# Altium project Stepper_Driver.PrjPcb
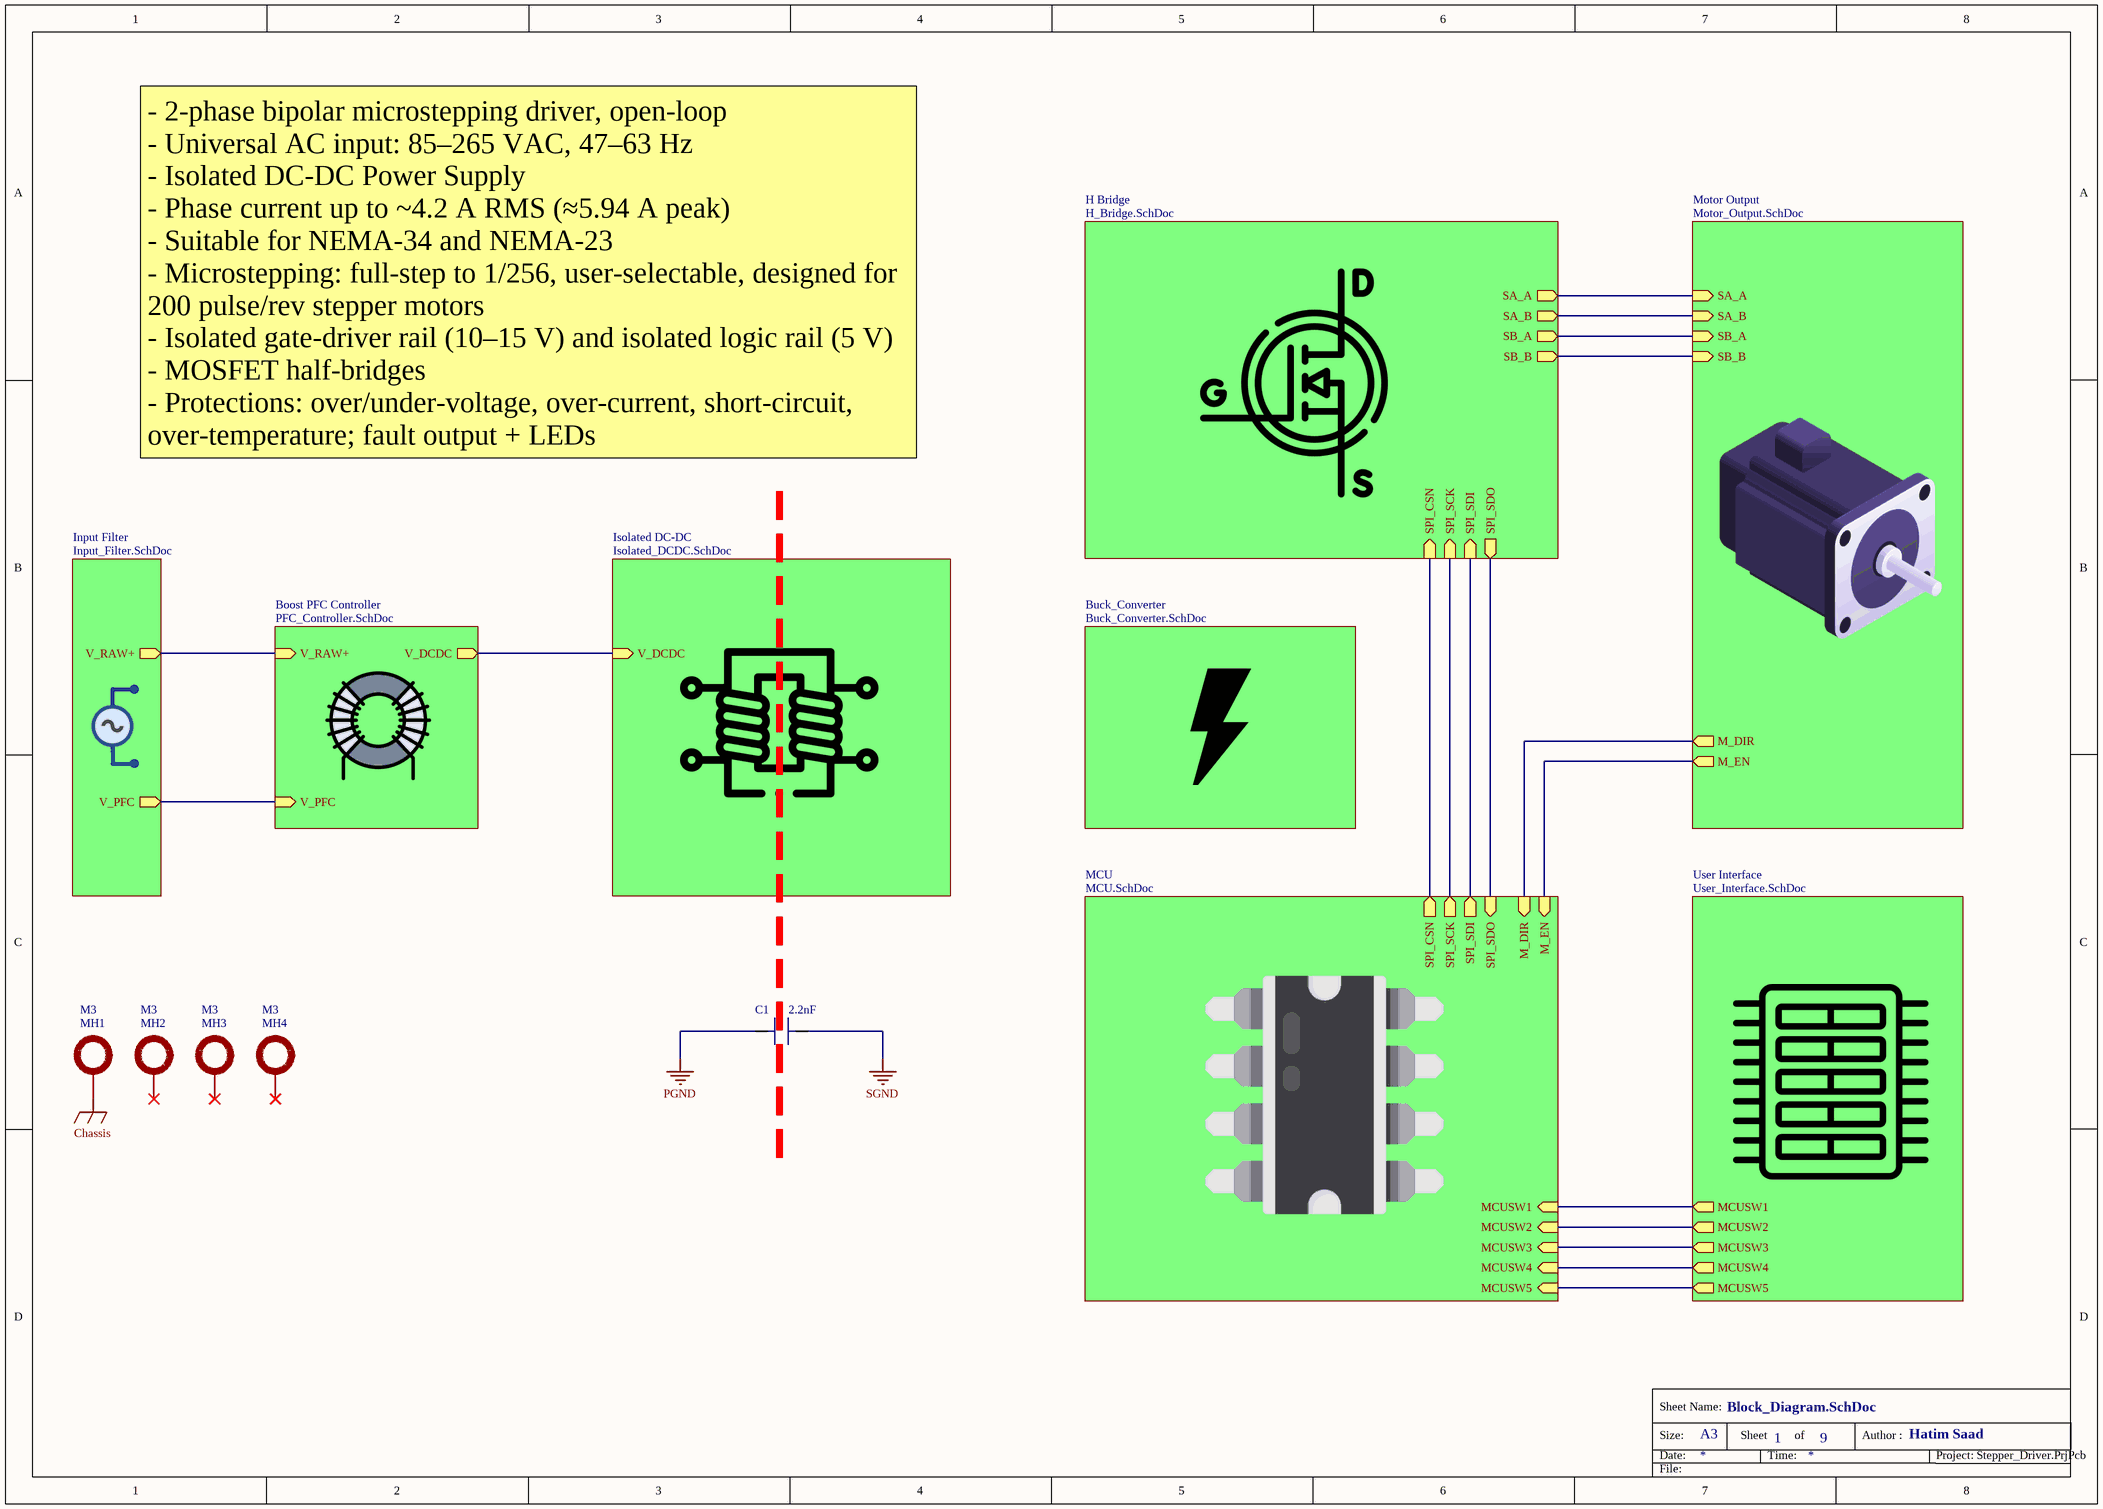
[diagram p0: Block_Diagram.SchDoc]
9 sheets, 208 parts. Net scope: hierarchical (ports join the sheet entries above them; power ports are global).
Board file: Stepper_Board.PcbDoc
Sheets:
  Block_Diagram.SchDoc
    Input Filter = Input_Filter.SchDoc
    Boost PFC Controller = PFC_Controller.SchDoc
    Isolated DC-DC = Isolated_DCDC.SchDoc
    H Bridge = H_Bridge.SchDoc
    MCU = MCU.SchDoc
    User Interface = User_Interface.SchDoc
    Motor Output = Motor_Output.SchDoc
    Buck_Converter = Buck_Converter.SchDoc

## Sheet Block_Diagram.SchDoc
size A3; SheetNumber: 1; SheetTotal: 9

### Parts
C1  2.2nF  [C10MM]
MH1  M3  [M3 Mounting Hole]  (no BOM)
MH2  M3  [M3 Mounting Hole]  (no BOM)
MH3  M3  [M3 Mounting Hole]  (no BOM)
MH4  M3  [M3 Mounting Hole]  (no BOM)

### Sub-sheets
Boost PFC Controller = PFC_Controller.SchDoc: V_RAW+ (in), V_PFC (in), V_DCDC (out)
Buck_Converter = Buck_Converter.SchDoc: no entries
H Bridge = H_Bridge.SchDoc: SPI_CSN (in), SPI_SCK (in), SPI_SDI (in), SPI_SDO (out), SA_A (out), SA_B (out), SB_A (out), SB_B (out)
Input Filter = Input_Filter.SchDoc: V_RAW+ (out), V_PFC (out)
Isolated DC-DC = Isolated_DCDC.SchDoc: V_DCDC (in)
MCU = MCU.SchDoc: SPI_CSN (out), SPI_SCK (out), SPI_SDI (out), SPI_SDO (in), MCUSW5 (in), MCUSW4 (in), MCUSW3 (in), MCUSW2 (in), MCUSW1 (in), M_DIR (in), M_EN (in)
Motor Output = Motor_Output.SchDoc: SA_A (in), SA_B (in), SB_A (in), SB_B (in), M_DIR (out), M_EN (out)
User Interface = User_Interface.SchDoc: MCUSW5 (out), MCUSW4 (out), MCUSW3 (out), MCUSW2 (out), MCUSW1 (out)

### Nets
Chassis: MH1.1
PGND: C1.1(A)
SGND: C1.2(B)
M_DIR: sheet MCU/M_DIR, sheet Motor Output/M_DIR
M_EN: sheet MCU/M_EN, sheet Motor Output/M_EN
MCUSW1: sheet MCU/MCUSW1, sheet User Interface/MCUSW1
MCUSW2: sheet MCU/MCUSW2, sheet User Interface/MCUSW2
MCUSW3: sheet MCU/MCUSW3, sheet User Interface/MCUSW3
MCUSW4: sheet MCU/MCUSW4, sheet User Interface/MCUSW4
MCUSW5: sheet MCU/MCUSW5, sheet User Interface/MCUSW5
MISO: sheet H Bridge/SPI_SDO, sheet MCU/SPI_SDO
MOSI: sheet H Bridge/SPI_SDI, sheet MCU/SPI_SDI
SA_A: sheet H Bridge/SA_A, sheet Motor Output/SA_A
SA_B: sheet H Bridge/SA_B, sheet Motor Output/SA_B
SB_A: sheet H Bridge/SB_A, sheet Motor Output/SB_A
SB_B: sheet H Bridge/SB_B, sheet Motor Output/SB_B
SCK: sheet H Bridge/SPI_SCK, sheet MCU/SPI_SCK
SCSN: sheet H Bridge/SPI_CSN, sheet MCU/SPI_CSN
V_DCDC: sheet Boost PFC Controller/V_DCDC, sheet Isolated DC-DC/V_DCDC
V_PFC: sheet Input Filter/V_PFC, sheet Boost PFC Controller/V_PFC
V_RAW+: sheet Input Filter/V_RAW+, sheet Boost PFC Controller/V_RAW+

Not connected (* = marked no-connect by the designer): MH2 1*; MH3 1*; MH4 1*

### Notes on the sheet
- - 2-phase bipolar microstepping driver, open-loop
  - Universal AC input: 85–265 VAC, 47–63 Hz
  - Isolated DC-DC Power Supply
  - Phase current up to ~4.2 A RMS (≈5.94 A peak)
  - Suitable for NEMA-34 and NEMA-23
  - Microstepping: full-step to 1/256, user-selectable, designed for 200 pulse/rev stepper motors
  - Isolated gate-driver rail (10–15 V) and isolated logic rail (5 V)
  - MOSFET half-bridges
  - Protections: over/under-voltage, over-current, short-circuit, over-temperature; fault output + LEDs
  - EMC Standards
- Size:
- Date:
- Sheet Name:
- A3
- Sheet
- Time:
- of
- Author :
- Hatim Saad
- Project:
- File:

### Library data of the parts
C1 = CD45-E2GA222M-NKA: Safety Capacitors D: 9mm X1/Y1 2200pF E 20% LS:10mm; Supplier 1: Mouser; Supplier Part Number 1: 810-CD45-E2GA222MNKA
MH1-MH4 = Mounting Hole M3: Mounting Hole M3 Screw

## Sheet Input_Filter.SchDoc
size A4; SheetNumber: 2; SheetTotal: 9
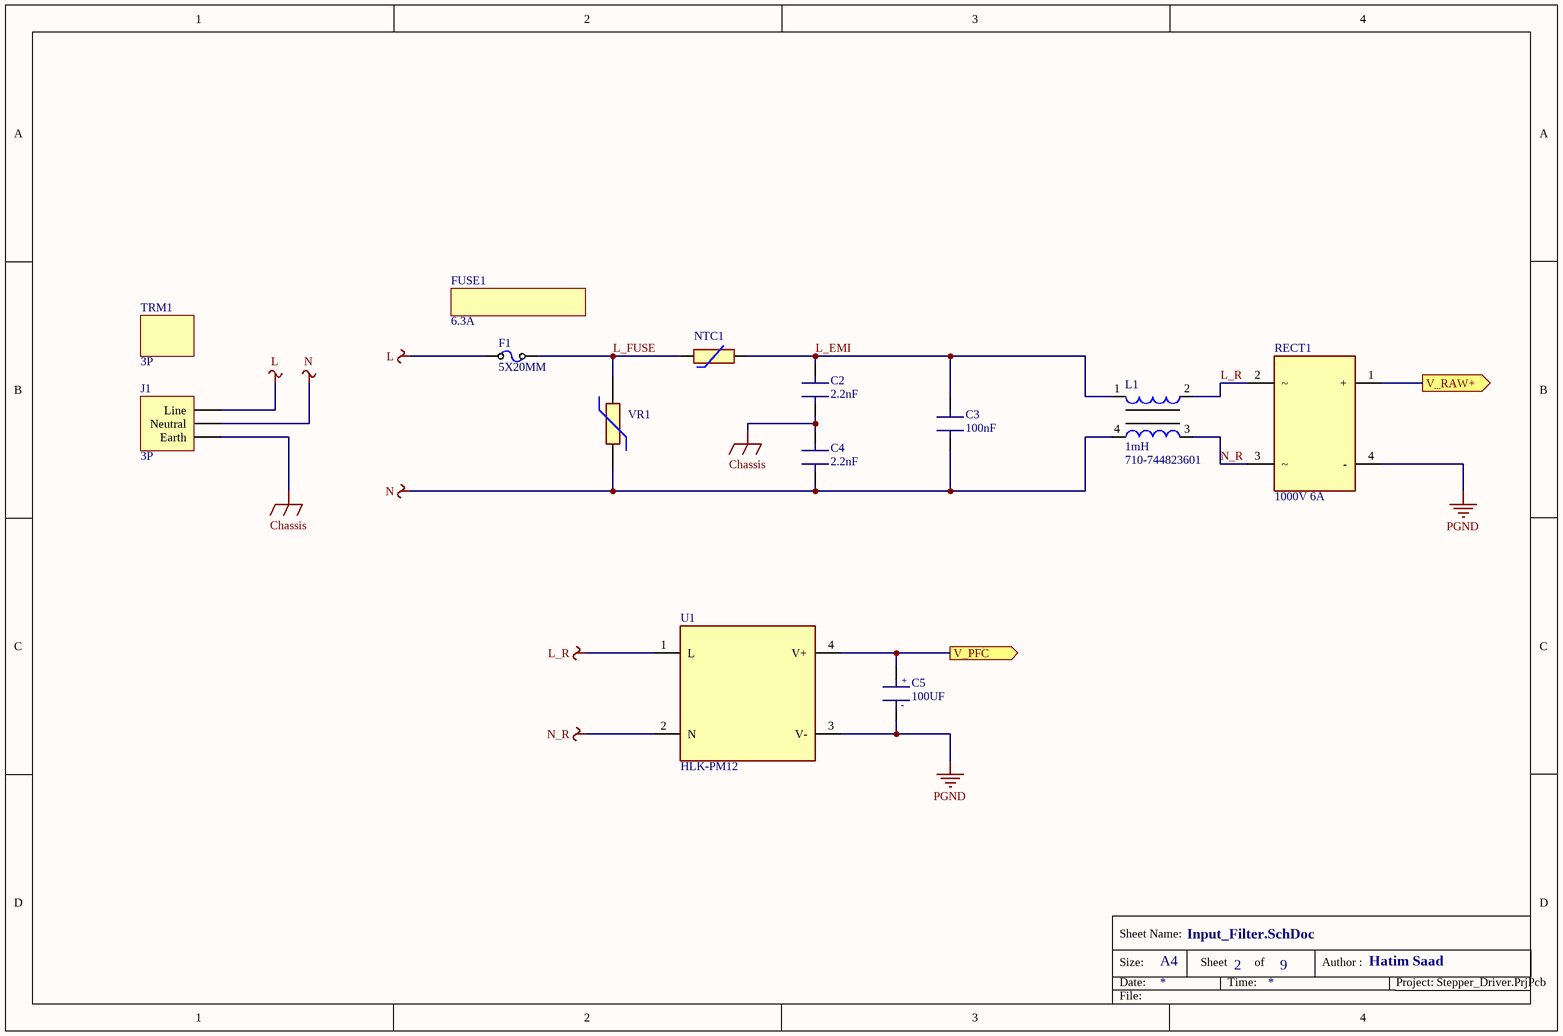
[diagram p1: Input_Filter.SchDoc]

### Parts
C2  2.2nF  [CAP: 10MM Ceramic Disc]
C3  100nF  [CAP: 15MM Film Capacitor]
C4  2.2nF  [CAP: 10MM Ceramic Disc]
C5  100UF  [CAP SMD 8]
F1  5X20MM  [FUSE HOLDER 5X20MM]
FUSE1  6.3A  (mechanical)
J1  3P  [691313510003]
L1  1mH  Supplier Part Number 1: 710-744823601  [744823601]
NTC1  BN-LG15Y6R0MYB  [NTC Radial: 7.5X1MM]  (value not drawn)
RECT1  1000V 6A  [TBSG-4]
TRM1  3P  (mechanical)
U1  HLK-PM12  [HLK-PM01]
VR1  275VAC  [B72307S0271K101]  (value not drawn)

### Ports
V_PFC (out), V_RAW+ (out)

### Nets
Chassis: C2.1(A) C4.2(B) J1.3(Earth)
L: F1.1 J1.1(Line)
L_R: L1.2 RECT1.2 U1.1(L)
N: C3.1(A) C4.1(A) J1.2(Neutral) L1.4 VR1.1
N_R: L1.3 RECT1.3 U1.2(N)
PGND: C5.2(-) RECT1.4(-) U1.3(V-)
L_EMI: C2.2(B) C3.2(B) L1.1 NTC1.2
L_FUSE: F1.2 NTC1.1 VR1.2
V_PFC: C5.1(+) U1.4(V+) ; port V_PFC
V_RAW+: RECT1.1(+) ; port V_RAW+

### Notes on the sheet
- Size:
- Date:
- Sheet Name:
- A4
- Sheet
- Time:
- of
- Author :
- Hatim Saad
- Project:
- File:

### Library data of the parts
C2 C4 = VY1222M43Y5UC63V0: Safety Capacitors 2200pF X760 Y500VAC 20% Y5U; Supplier 1: Mouser; Supplier Part Number 1: 72-VY1222M43Y5UC63V0
C3 = R46KI310050M1M: Safety Capacitors 275vac 0.1uF 20%; Supplier 1: Mouser; Supplier Part Number 1: 80-R46KI310050M1M
C5 = EDK107M050A9MAA: Aluminium Electrolytic Capacitors - SMD 50V 100uF 20%; Supplier 1: Mouser; Supplier Part Number 1: 80-EDK107M050A9MAA
F1 = 0PTF0078P: Fuse Holder 5X20MM Pitch 22/7 UL94V0 Open; Supplier 1: Mouser; Supplier Part Number 1: 576-0PTF0078P
FUSE1 = 0034.3125: Cartridge Fuses FST 5X20 250V 6.3A; Supplier 1: Mouser; Supplier Part Number 1: 693-0034.3125
J1 = 691313510003: Pluggable Terminal Blocks WR-TBL 300VAC 20A 3P Right Angle; Supplier 1: Mouser; Supplier Part Number 1: 710-691313510003
L1 = 744823601: Common Mode Chokes / Filters WE-CMB Choke Type M 1mH 6A 13mOhm; Supplier 1: Mouser
NTC1 = BN-LG15Y6R0MYB: NTC (Negative Temperature Coefficient) Thermistors 15 dia Power NTC 6ohm Y kink bulk; Supplier 1: Mouser; Supplier Part Number 1: 652-BN-LG15Y6R0MYB
RECT1 = TBSA60M-TP: Bridge Rectifiers BRIDGE RECTIFIERS 1000V 6A, TBSG; Supplier 1: Mouser; Supplier Part Number 1: 833-TBSA60M-TP
TRM1 = 691351500003: Pluggable Terminal Blocks WR-TBL 300VAC 20A 3P Right Angle; Supplier 1: Mouser; Supplier Part Number 1: 710-691351500003
U1 = HLK-PM12: AC-DC Module 3W 220Vac to 12Vdc; Supplier 1: LCSC; Supplier Part Number 1: C209905
VR1 = B72307S0271K101: Varistors 7mm, 275Vac, 10%, Compact Series; Supplier 1: Mouser; Supplier Part Number 1: 871-B72307S0271K101

## Sheet PFC_Controller.SchDoc
size A3; SheetNumber: 3; SheetTotal: 9
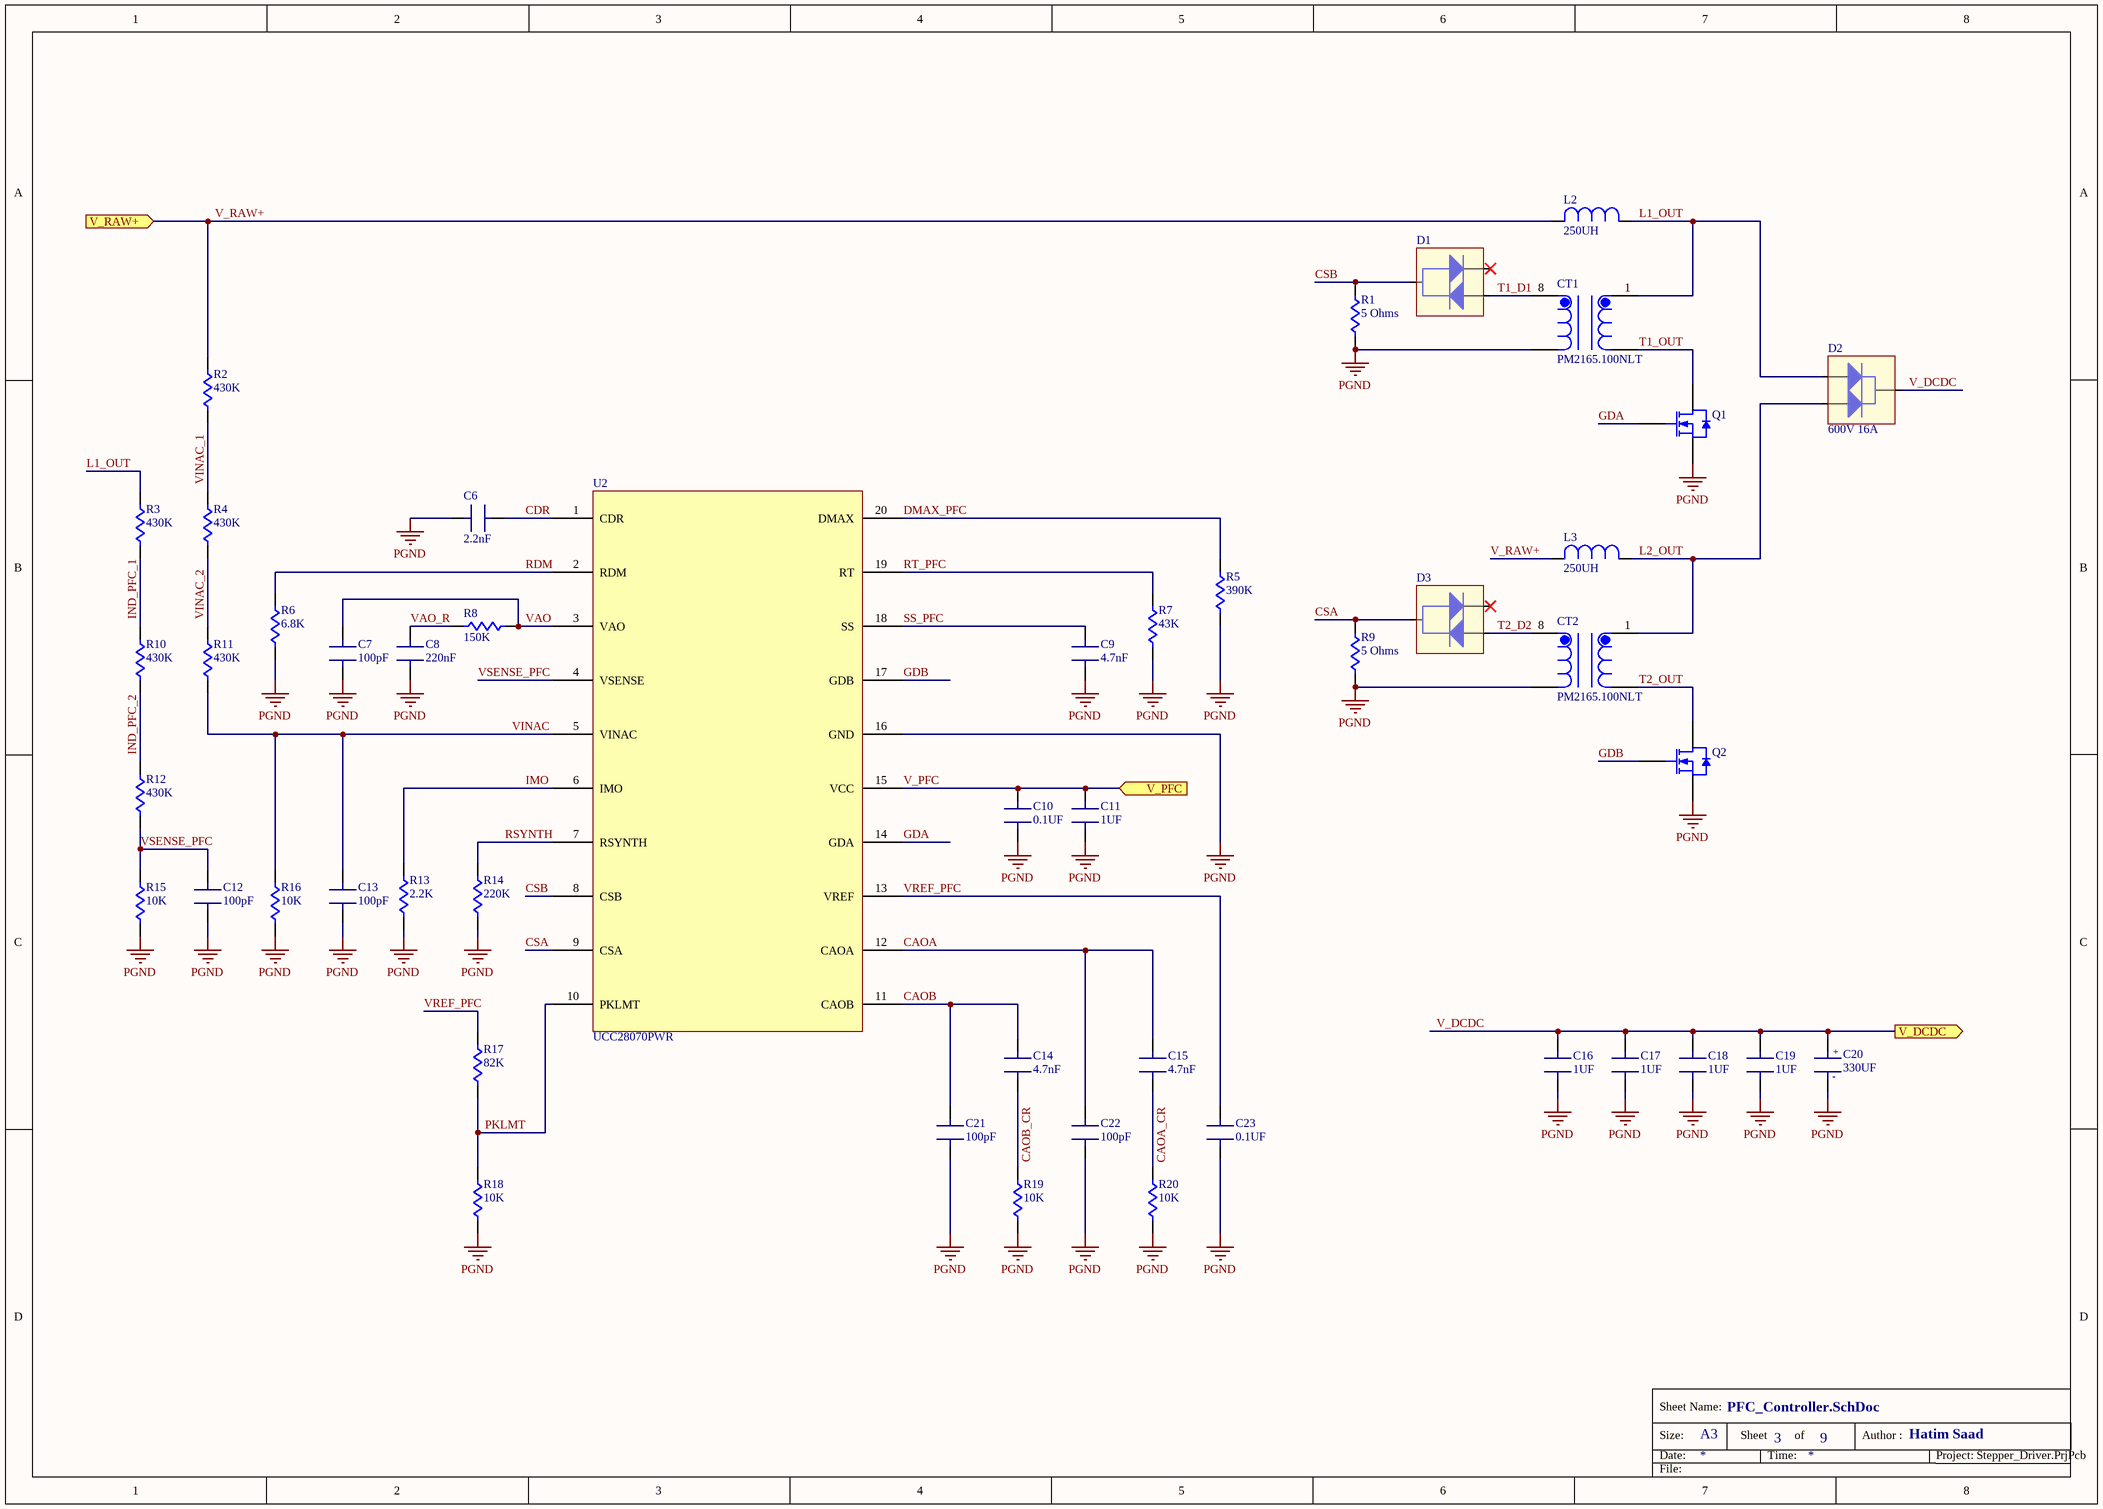
[diagram p2: PFC_Controller.SchDoc]

### Parts
C6  2.2nF  [CAP: 0603]
C7  100pF  [CAP: 0603]
C8  220nF  [CAP: 0603]
C9  4.7nF  [CAP: 0603]
C10  0.1UF  [CAP: 0603]
C11  1UF  [CAP: 0603]
C12  100pF  [CAP: 0603]
C13  100pF  [CAP: 0603]
C14  4.7nF  [CAP: 0603]
C15  4.7nF  [CAP: 0603]
C16  1UF  [CAP: 2220]
C17  1UF  [CAP: 2220]
C18  1UF  [CAP: 2220]
C19  1UF  [CAP: 2220]
C20  330UF  [CAP: 10MM D: 35MM L: 25MM Snap In]
C21  100pF  [CAP: 0603]
C22  100pF  [CAP: 0603]
C23  0.1UF  [CAP: 0603]
CT1  PM2165.100NLT  [CT: PM2165.100NLT]
CT2  PM2165.100NLT  [CT: PM2165.100NLT]
D1  BAT54SWT1G  [SOT323]  (value not drawn)
D2  600V 16A  [D2PAK]
D3  BAT54SWT1G  [SOT323]  (value not drawn)
L2  250UH  [IND: ATCA-08-251M-H]
L3  250UH  [IND: ATCA-08-251M-H]
Q1  IPT60R099CM8XTMA1  [8-HSOF]  (value not drawn)
Q2  IPT60R099CM8XTMA1  [8-HSOF]  (value not drawn)
R1  5 Ohms  [RES: 1206]
R2  430K  [RES: 2512]
R3  430K  [RES: 2512]
R4  430K  [RES: 2512]
R5  390K  [RES: 0603]
R6  6.8K  [RES: 0603]
R7  43K  [RES: 0603]
R8  150K  [RES: 0603]
R9  5 Ohms  [RES: 1206]
R10  430K  [RES: 2512]
R11  430K  [RES: 2512]
R12  430K  [RES: 2512]
R13  2.2K  [RES: 0603]
R14  220K  [RES: 0603]
R15  10K  [RES: 0603]
R16  10K  [RES: 0603]
R17  82K  [RES: 0603]
R18  10K  [RES: 0603]
R19  10K  [RES: 0603]
R20  10K  [RES: 0603]
U2  UCC28070PWR  [20-TSSOP]

### Ports
V_DCDC (out), V_PFC (in), V_RAW+ (in)

### Nets
PGND: C6.2(B) C7.1(A) C8.1(A) C9.1(A) C10.1(A) C11.1(A) C12.1(A) C13.1(A) C16.1(A) C17.1(A) C18.1(A) C19.1(A) C20.2(-) C21.1(A) C22.1(A) C23.1(A) CT1.7(S) CT2.7(S) Q1.3(S) Q2.3(S) R1.1 R5.1 R6.1 R7.1 R9.1 R13.1 R14.1 R15.1 R16.1 R18.1 R19.1 R20.1 U2.16(GND)
CAOA: C15.2(B) C22.2(B) U2.12(CAOA)
CAOA_CR: C15.1(A) R20.2
CAOB: C14.2(B) C21.2(B) U2.11(CAOB)
CAOB_CR: C14.1(A) R19.2
CDR: C6.1(A) U2.1(CDR)
CSA: D3.3(A/K) R9.2 U2.9(CSA)
CSB: D1.3(A/K) R1.2 U2.8(CSB)
DMAX_PFC: R5.2 U2.20(DMAX)
GDA: Q1.1(G) U2.14(GDA)
GDB: Q2.1(G) U2.17(GDB)
IMO: R13.2 U2.6(IMO)
IND_PFC_1: R3.1 R10.2
IND_PFC_2: R10.1 R12.2
L1_OUT: CT1.1(P) D2.1(A) L2.2 R3.2
L2_OUT: CT2.1(P) D2.3(A) L3.2
PKLMT: R17.1 R18.2 U2.10(PKLMT)
RDM: R6.2 U2.2(RDM)
RSYNTH: R14.2 U2.7(RSYNTH)
RT_PFC: R7.2 U2.19(RT)
SS_PFC: C9.2(B) U2.18(SS)
T1_D1: CT1.8(S) D1.1(A)
T1_OUT: CT1.3(P) Q1.2(D)
T2_D2: CT2.8(S) D3.1(A)
T2_OUT: CT2.3(P) Q2.2(D)
V_DCDC: C16.2(B) C17.2(B) C18.2(B) C19.2(B) C20.1(+) D2.2(K) ; port V_DCDC
V_PFC: C10.2(B) C11.2(B) U2.15(VCC) ; port V_PFC
V_RAW+: L2.1 L3.1 R2.2 ; port V_RAW+
VAO: C7.2(B) R8.2 U2.3(VAO)
VAO_R: C8.2(B) R8.1
VINAC: C13.2(B) R11.1 R16.2 U2.5(VINAC)
VINAC_1: R2.1 R4.2
VINAC_2: R4.1 R11.2
VREF_PFC: C23.2(B) R17.2 U2.13(VREF)
VSENSE_PFC: C12.2(B) R12.1 R15.2 U2.4(VSENSE)

Not connected (* = marked no-connect by the designer): D1 2(K)*; D3 2(K)*

### Notes on the sheet
- Size:
- Date:
- Sheet Name:
- A3
- Sheet
- Time:
- of
- Author :
- Hatim Saad
- Project:
- File:

### Library data of the parts
C6-C15 C21-C23 = CAP 0603: CAP SMD 0603
C16-C19 = GR355XD7LP105KW05L: Multilayer Ceramic Capacitors MLCC - SMD/SMT 1 uF 450 VDC 10% 2220 X7T; Supplier 1: Mouser; Supplier Part Number 1: 81-GR355X7LP105KW05L
C20 = ESMR451VSN331MA25S: Aluminium Electrolytic Capacitors - Snap In 450V 330uF 20% Tol.; Supplier 1: Mouser; Supplier Part Number 1: 661-ESMR451N331MA25S
CT1 CT2 = PM2165.100NLT: Current Transformers 2mH 1000V AEC-Q200 20A DCR=0.75mOhms; Supplier 1: Mouser; Supplier Part Number 1: 673-PM2165.100NLT
D1 D3 = BAT54SWT1G: Schottky Diodes & Rectifiers 30V 200mW Dual; Supplier 1: Mouser; Supplier Part Number 1: 863-BAT54SWT1G
D2 = VS-HFA16TA60CS-M3: Schottky Diodes & Rectifiers 600V 16A TO-263 HexFred; Supplier 1: Mouser; Supplier Part Number 1: 78-VS-HFA16TA60CS-M3
L2 L3 = ATCA-08-251M-H: FIXED IND 250UH 10A 27 MOHM TH; Supplier 1: Mouser; Supplier Part Number 1: 815-ATCA-08-251M-H
Q1 Q2 = IPT60R099CM8XTMA1: MOSFETs 600V CoolMOS CM8 Power Transistor; Supplier 1: Mouser; Supplier Part Number 1: 726-IPT60R099CM8XTMA
R1 R9 = CSRT1206FT5R00: Current Sense Resistors - SMD 5Ohms 1206 1W 1% Thin Curr Sens AEC-Q200; Supplier 1: Mouser; Supplier Part Number 1: 708-CSRT1206FT5R00
R2-R4 R10-R12 = RES 2512: RES SMD 2512
R5-R8 R13-R20 = RES 0603: RES SMD 0603
U2 = UCC28070PWR: Power Factor Correction - PFC 2Phase Interleaved C CM PFC Controller A 595-UCC28070PW; Supplier 1: Mouser; Supplier Part Number 1: 595-UCC28070PWR

## Sheet Isolated_DCDC.SchDoc
size A3; SheetNumber: 4; SheetTotal: 9
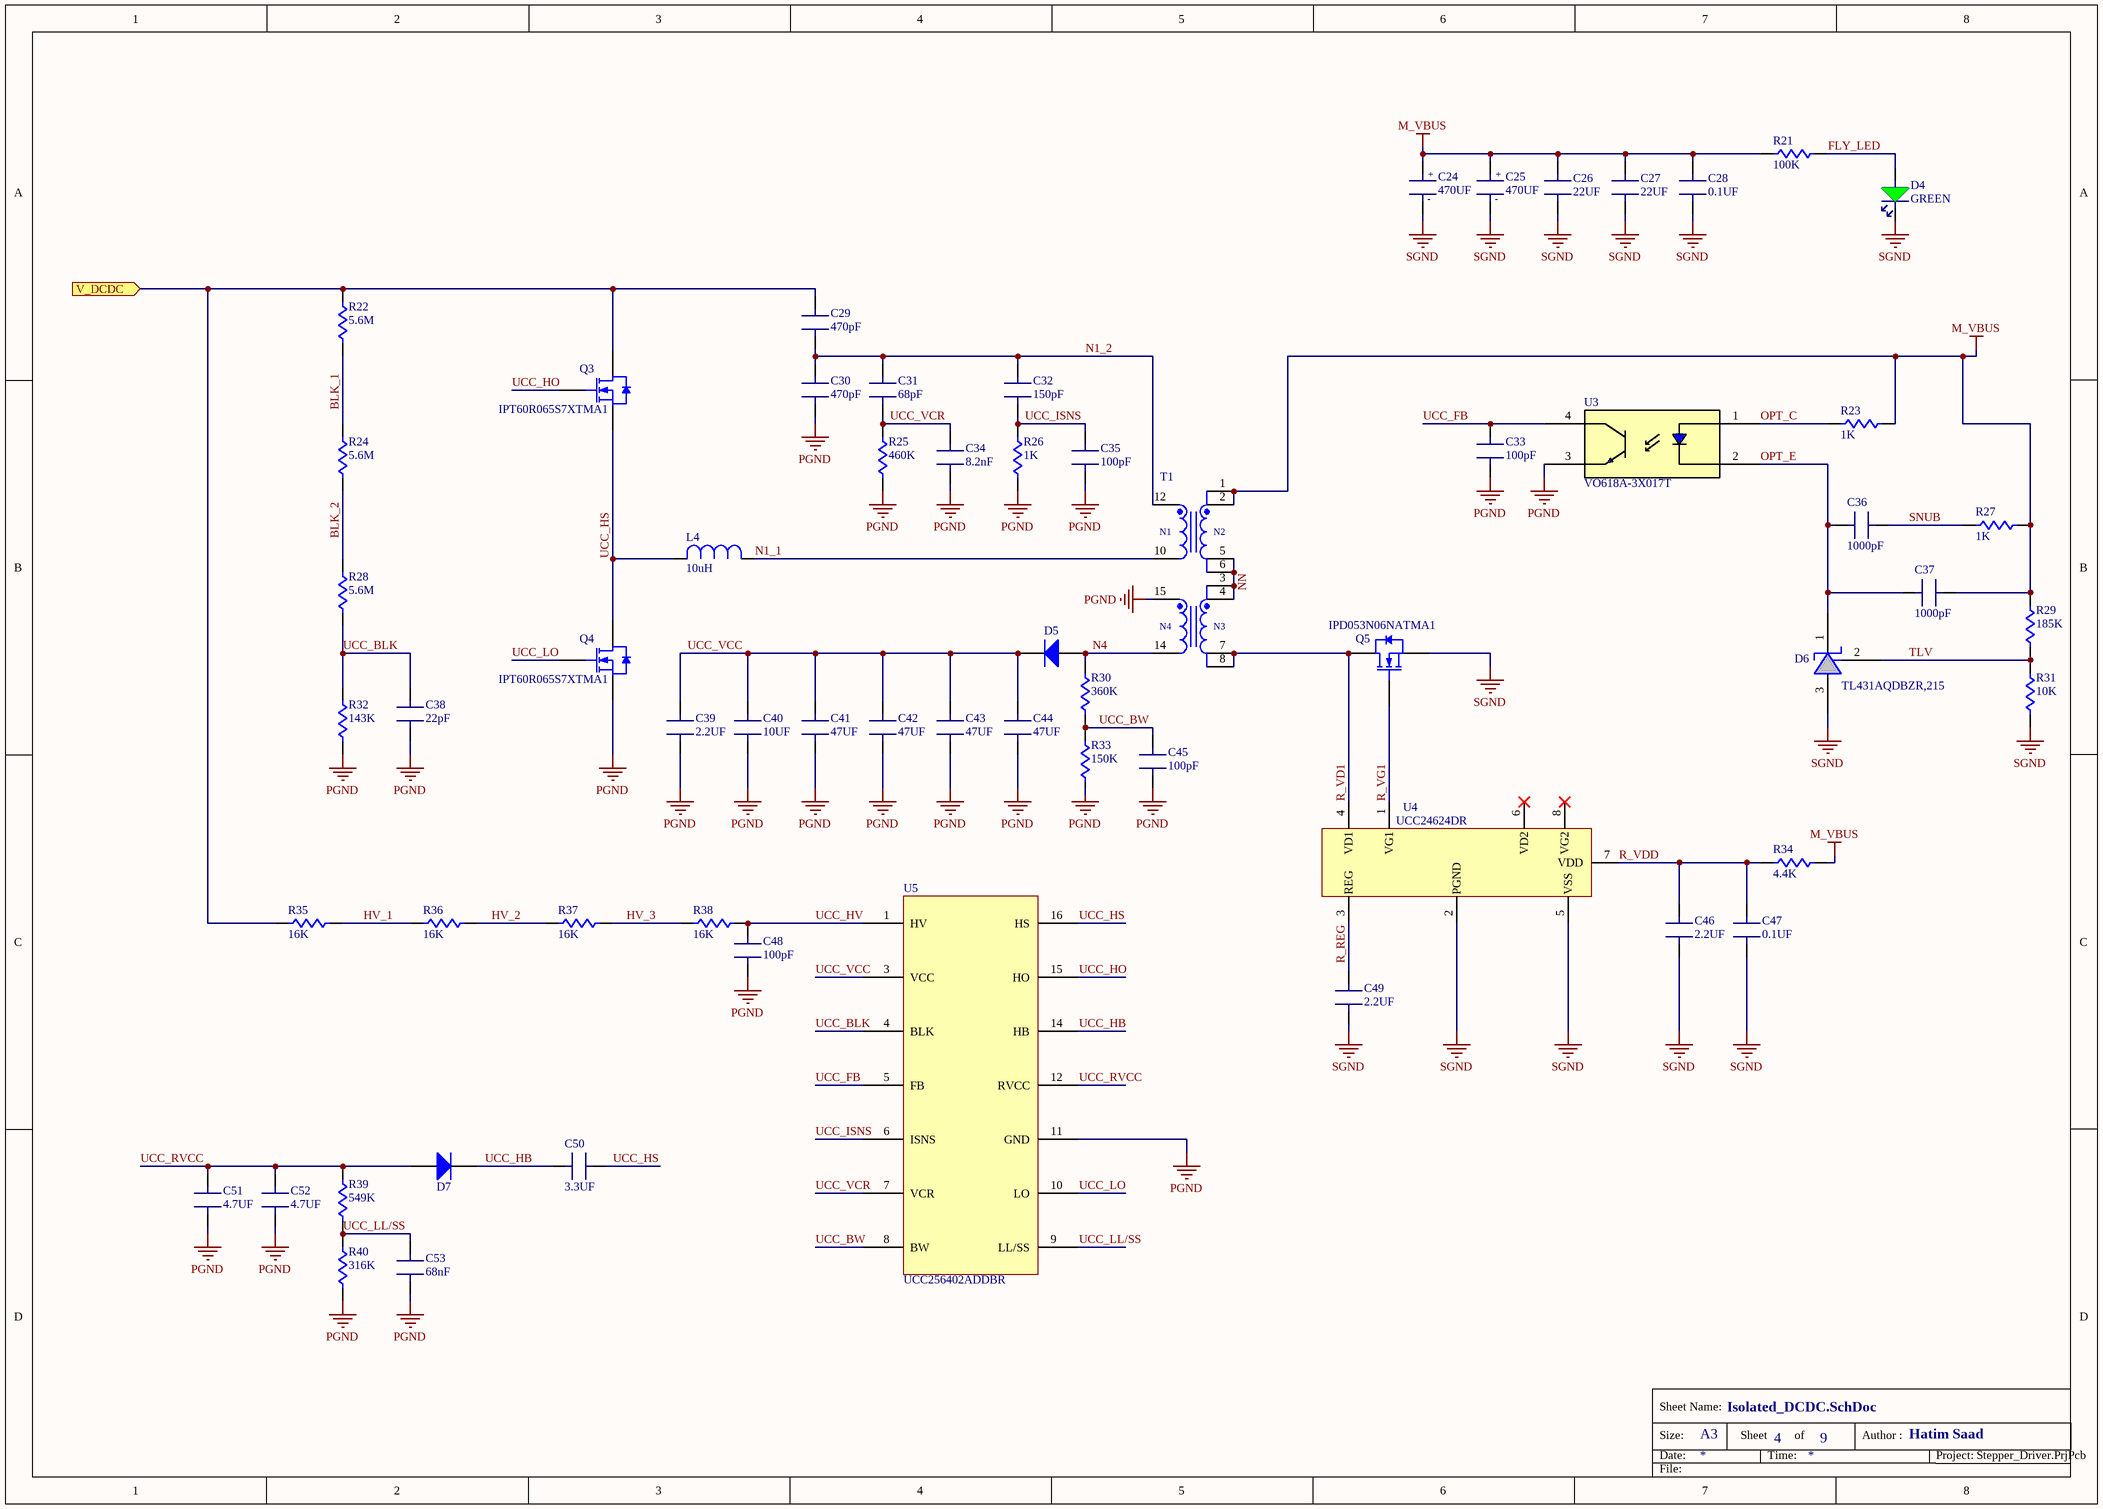
[diagram p3: Isolated_DCDC.SchDoc]

### Parts
C24  470UF  [CAP: D16C7.5H25]
C25  470UF  [CAP: D16C7.5H25]
C26  22UF  [CAP: 0805]
C27  22UF  [CAP: 0805]
C28  0.1UF  [CAP: 0603]
C29  470pF  [CAP: 1206]
C30  470pF  [CAP: 1206]
C31  68pF  [CAP: 1206]
C32  150pF  [CAP: 1206]
C33  100pF  [CAP: 0603]
C34  8.2nF  [CAP: 0603]
C35  100pF  [CAP: 0603]
C36  1000pF  [CAP: 0603]
C37  1000pF  [CAP: 0603]
C38  22pF  [CAP: 0603]
C39  2.2UF  [CAP: 0603]
C40  10UF  [CAP: 0805]
C41  47UF  [CAP: 1206]
C42  47UF  [CAP: 1206]
C43  47UF  [CAP: 1206]
C44  47UF  [CAP: 1206]
C45  100pF  [CAP: 0603]
C46  2.2UF  [CAP: 0603]
C47  0.1UF  [CAP: 0603]
C48  100pF  [CAP: 1206]
C49  2.2UF  [CAP: 0603]
C50  3.3UF  [CAP: 1206]
C51  4.7UF  [CAP: 0603]
C52  4.7UF  [CAP: 0603]
C53  68nF  [CAP: 0603]
D4  GREEN  [LED: 0603G]
D5  V1PM15-M3/H  [DO-219AD-2]  (value not drawn)
D6  TL431AQDBZR,215  [SOT23(TO-236AB)_NEX]
D7  V1PM15-M3/H  [DO-219AD-2]  (value not drawn)
L4  10uH  [IND: PQ2614BLA100K]
Q3  IPT60R065S7XTMA1  [8-HSOF]
Q4  IPT60R065S7XTMA1  [8-HSOF]
Q5  IPD053N06NATMA1  [DPAK_3]
R21  100K  [RES: 0603]
R22  5.6M  [RES: 2512]
R23  1K  [RES: 0603]
R24  5.6M  [RES: 2512]
R25  460K  [RES: 0603]
R26  1K  [RES: 0603]
R27  1K  [RES: 0603]
R28  5.6M  [RES: 2512]
R29  185K  [RES: 0603]
R30  360K  [RES: 0603]
R31  10K  [RES: 0603]
R32  143K  [RES: 0603]
R33  150K  [RES: 0603]
R34  4.4K  [RES: 0603]
R35  16K  [RES: 2512]
R36  16K  [RES: 2512]
R37  16K  [RES: 2512]
R38  16K  [RES: 2512]
R39  549K  [RES: 1206]
R40  316K  [RES: 0603]
T1  360-400Vin, 24Vout, 250W  [WE-LLCR_ETD44]  (value not drawn)
U3  VO618A-3X017T  [4-SMD_2]
U4  UCC24624DR  [8-SOIC]
U5  UCC256402ADDBR  [14-SOIC (DDB)]

### Ports
V_DCDC (in)

### Nets
M_VBUS: C24.1(+) C25.1(+) C26.2(B) C27.2(B) C28.2(B) C37.1(A) R21.2 R23.1 R27.1 R29.1 R34.2 T1.1 T1.2
PGND: C30.1(A) C33.1(A) C34.1(A) C35.1(A) C38.1(A) C39.1(A) C40.1(A) C41.1(A) C42.1(A) C43.1(A) C44.1(A) C45.1(A) C48.1(A) C51.1(A) C52.1(A) C53.1(A) Q4.3(S) R25.1 R26.1 R32.1 R33.1 R40.1 T1.15 U3.3(E) U5.11(GND)
SGND: C24.2(-) C25.2(-) C26.1(A) C27.1(A) C28.1(A) C46.1(A) C47.1(A) C49.1(A) D4.1(C) D6.3 Q5.3(S) R31.2 U4.2(PGND) U4.5(VSS)
BLK_1: R22.1 R24.2
BLK_2: R24.1 R28.2
FLY_LED: D4.2(A) R21.1
HV_1: R35.2 R36.1
HV_2: R36.2 R37.1
HV_3: R37.2 R38.1
N1_1: L4.1 T1.10
N1_2: C29.1(A) C30.2(B) C31.2(B) C32.2(B) T1.12
N4: D5.2(A) R30.2 T1.14
NN: T1.3 T1.4 T1.5 T1.6
OPT_C: R23.2 U3.1(A)
OPT_E: C36.2(B) C37.2(B) D6.1 U3.2(C)
R_REG: C49.2(B) U4.3(REG)
R_VD1: Q5.4(D) T1.7 T1.8 U4.4(VD1)
R_VDD: C46.2(B) C47.2(B) R34.1 U4.7(VDD)
R_VG1: Q5.1(G) U4.1(VG1)
SNUB: C36.1(A) R27.2
TLV: D6.2 R29.2 R31.1
UCC_BLK: C38.2(B) R28.1 R32.2 U5.4(BLK)
UCC_BW: C45.2(B) R30.1 R33.2 U5.8(BW)
UCC_FB: C33.2(B) U3.4(C) U5.5(FB)
UCC_HB: C50.2(B) D7.1(K) U5.14(HB)
UCC_HO: Q3.1(G) U5.15(HO)
UCC_HS: C50.1(A) L4.2 Q3.3(S) Q4.2(D) U5.16(HS)
UCC_HV: C48.2(B) R38.2 U5.1(HV)
UCC_ISNS: C32.1(A) C35.2(B) R26.2 U5.6(ISNS)
UCC_LL/SS: C53.2(B) R39.1 R40.2 U5.9(LL/SS)
UCC_LO: Q4.1(G) U5.10(LO)
UCC_RVCC: C51.2(B) C52.2(B) D7.2(A) R39.2 U5.12(RVCC)
UCC_VCC: C39.2(B) C40.2(B) C41.2(B) C42.2(B) C43.2(B) C44.2(B) D5.1(K) U5.3(VCC)
UCC_VCR: C31.1(A) C34.2(B) R25.2 U5.7(VCR)
V_DCDC: C29.2(B) Q3.2(D) R22.2 R35.1 ; port V_DCDC

Not connected (* = marked no-connect by the designer): U4 6(VD2)* 8(VG2)*

### Notes on the sheet
- Size:
- Date:
- Sheet Name:
- A3
- Sheet
- Time:
- of
- Author :
- Hatim Saad
- Project:
- File:
- (in symbol 760895741) N1; N2; N4; N3

### Library data of the parts
C24 C25 = ESK477M100AM7AA: Aluminium Electrolytic Capacitors - Radial Leaded 100V 470uF 85C 2k Hour Radial; Supplier 1: Mouser; Supplier Part Number 1: 80-ESK477M100AM7AA
C26 C27 C40 = CAP 0805: CAP SMD 0805
C28 C33-C39 C45-C47 C49 C51-C53 = CAP 0603: CAP SMD 0603
C29-C32 C41-C44 C50 = CAP 1206: CAP SMD 1206
C48 = VJ1206A101JXGCW1HV: Multilayer Ceramic Capacitors MLCC - SMD/SMT 1206 100pF 5 % 1000V NP0; Supplier 1: Mouser; Supplier Part Number 1: 77-VJ1206A101JXGAT5Z
D4 = LED GREEN 0603: LED GREEN CLEAR 0603 SMD
D5 D7 = V1PM15-M3/H: Schottky Diodes & Rectifiers 150V 1A TMBS MicroSMP; Supplier 1: Mouser; Supplier Part Number 1: 78-V1PM15-M3/H
D6 = TL431AQDBZR,215: Shunt Voltage Reference IC Adjustable 2.495V 36 VV ±1% 100 mA TO-236AB; Supplier 1: Mouser; Supplier Part Number 1: 771-TL431AQDBZR215
L4 = PQ2614BLA-100K: Power Inductors - SMD 10uH 10% 30A AEC-Q200 GULL WING; Supplier 1: Mouser; Supplier Part Number 1: 652-PQ2614BLA-100K
Q3 Q4 = IPT60R065S7XTMA1: MOSFET N-CH 600V 8A 8HSOF; Supplier 1: Mouser; Supplier Part Number 1: 726-IPT60R065S7XTMA1
Q5 = IPD053N06NATMA1: MOSFETs N-Ch 60V 45A DPAK-2; Supplier 1: Mouser; Supplier Part Number 1: 726-IPD053N06NATMA1
R21 R23 R25-R27 R29-R34 R40 = RES 0603: RES SMD 0603
R22 R24 R28 = RES 2512: RES SMD 2512
R35-R38 = CRCW251216K9FKEG: Thick Film Resistors CRCW2512 100 16K9 1% E67 e3; Supplier 1: Mouser; Supplier Part Number 1: 71-CRCW251216K9FKEG
R39 = RES 1206: RES SMD 1206
T1 = 760895741: WE-LLCR Resonant Converter, THT, ETD44, 360-400Vin, 24Vout, 250W; Manufacturer: Wurth Elektronik; Auxiliary Voltage: 16V; Inductance: 400uH; Leakage Inductance: 65uH; Output Current: 10.4A; Output Voltage: 24V; Saturation Current: 4.3A; Switching Frequency: 70-120kHz; Turns Ratio: 27:3:3:2; Manufacturer Part Number: 760895741; Category: Transformers For AC-DC Converter; Match Code: WE-LLCR; ComponentLink1Description: Website Link; ComponentLink1URL: https://www.we-online.com/redexpert/article/760895741?ad; ComponentLink2Description: Datasheet Link; ComponentLink2URL: https://www.we-online.com/redexpert/spec/760895741?ad; Mount: Through Hole; Operating Temperature Max: 125°C; Operating Temperature Min: -40°C; Packaging: Tray; Case/Size Code: ETD44; Length: 48mm; Width: 46mm; Height: 27.5mm; Input Voltage: 360-400V; Output Power: 250W
U3 = VO618A-3X017T: Transistor Output Optocouplers Phototransistor Out CTR 100-200%; Supplier 1: Mouser; Supplier Part Number 1: 78-VO618A-3X017T
U4 = UCC24624DR: Gate Drivers High-frequency dual synchronous rectifi A 595-UCC24624DT; Supplier 1: Mouser; Supplier Part Number 1: 595-UCC24624DR
U5 = UCC256402ADDBR: Switching Controllers LLC resonant control ler with ultra-low s A 595-UCC256402ADDBT; Supplier 1: Mouser; Supplier Part Number 1: 595-UCC256402ADDBR

## Sheet H_Bridge.SchDoc
size A3; SheetNumber: 5; SheetTotal: 9
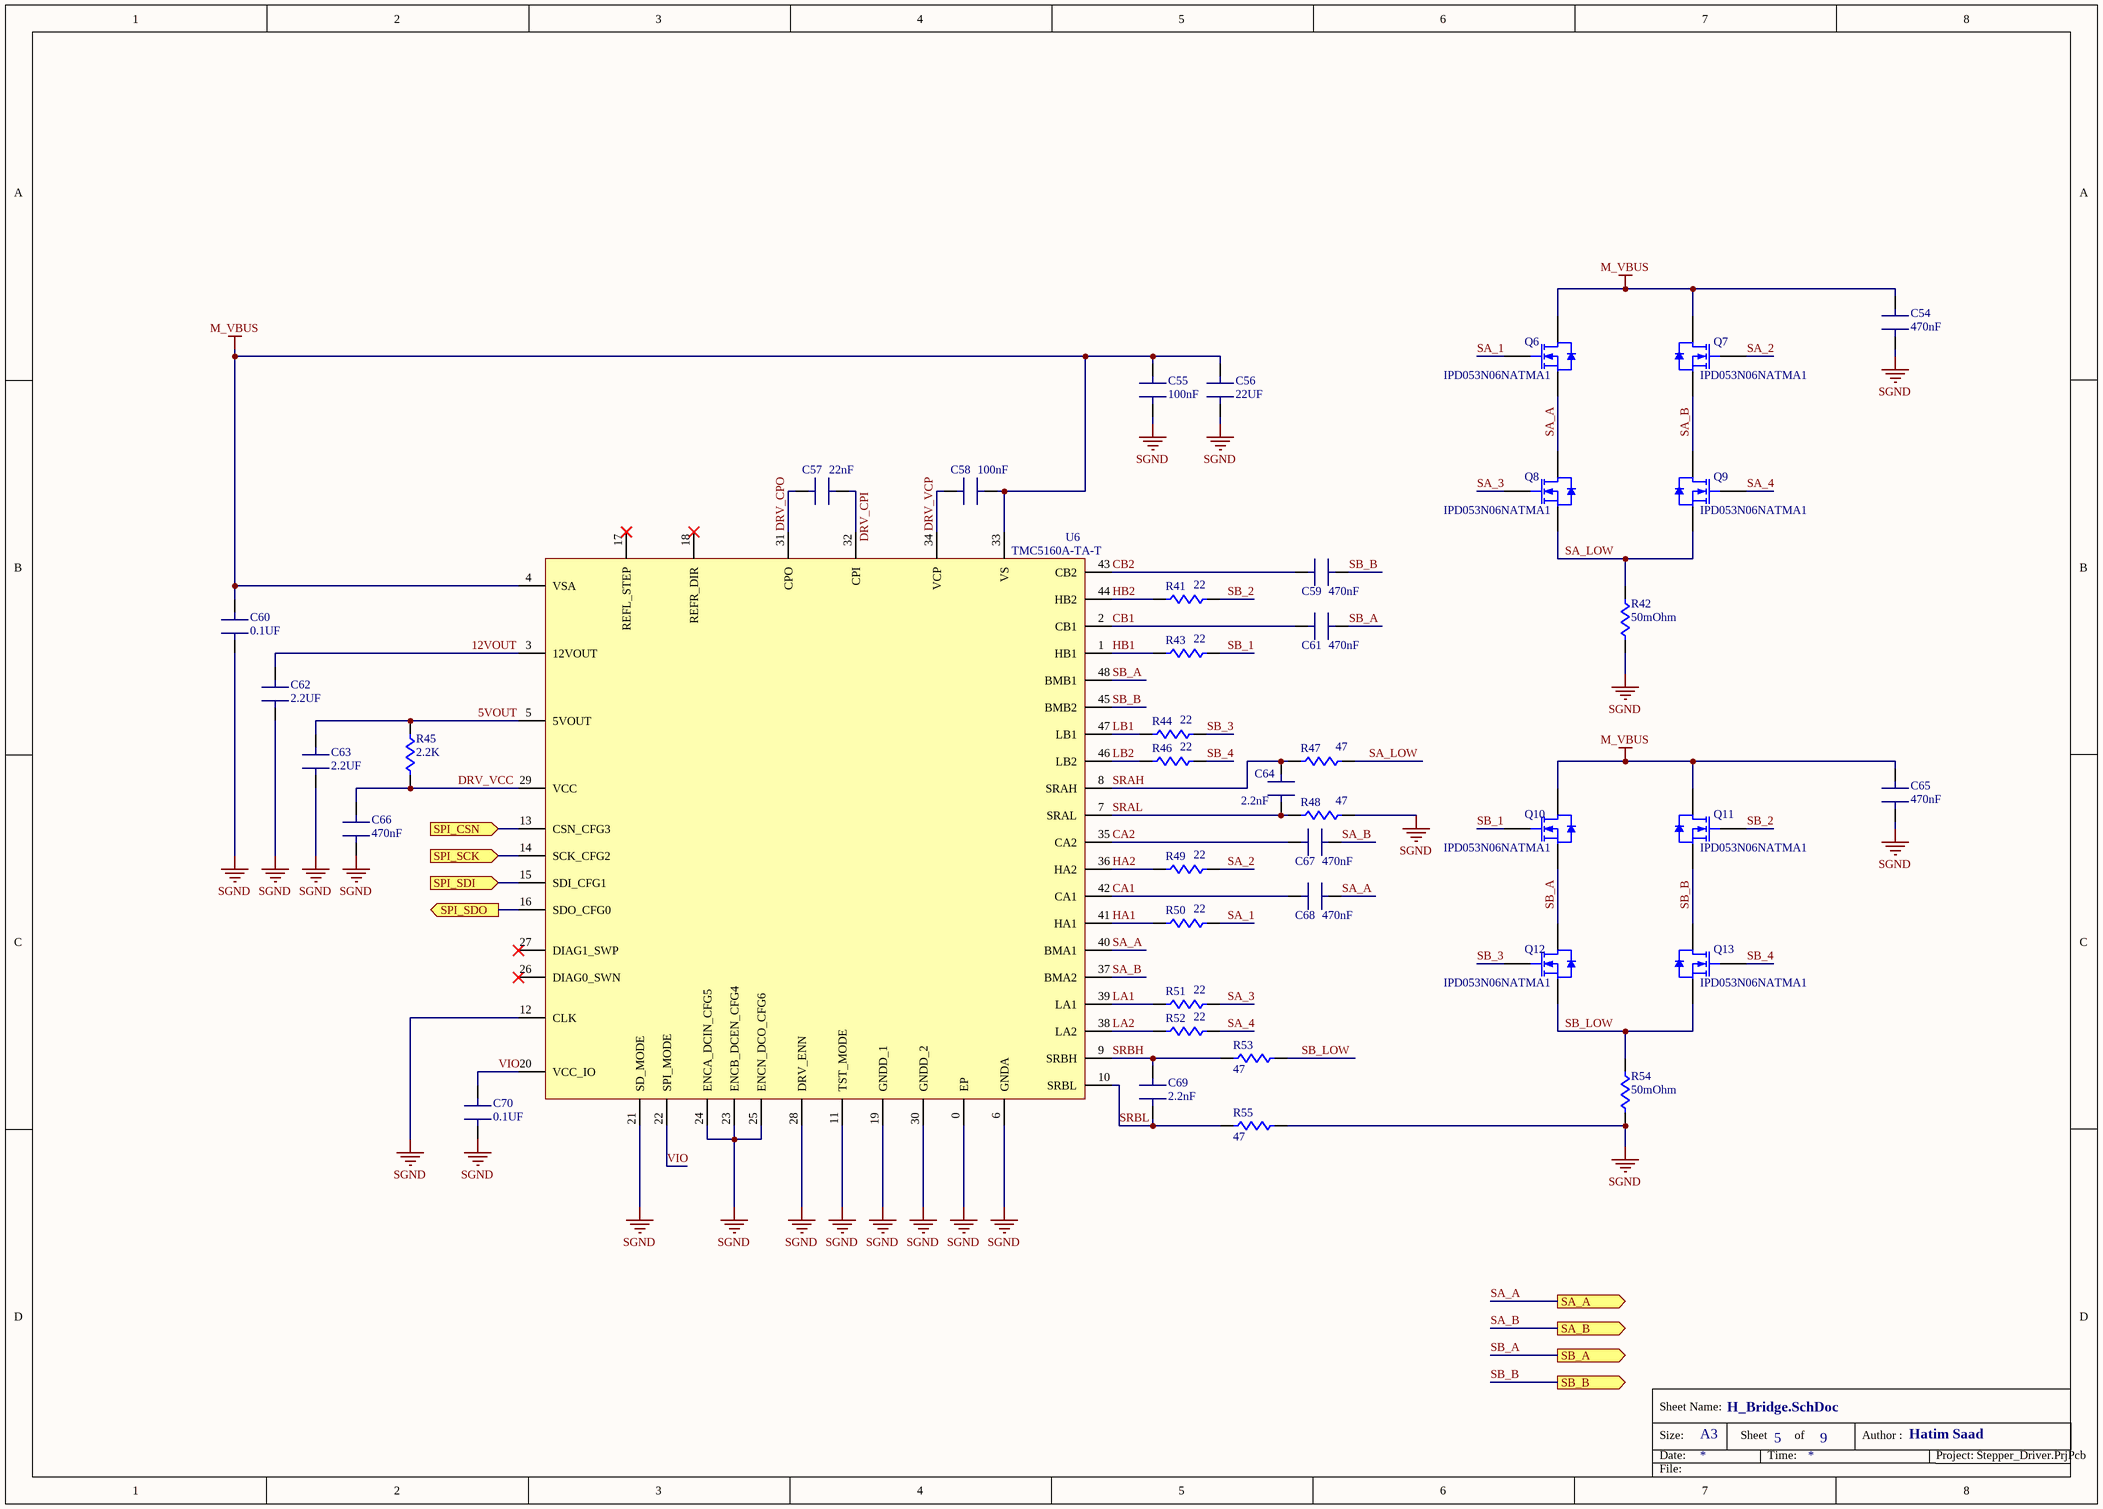
[diagram p4: H_Bridge.SchDoc]

### Parts
C54  470nF  [CAP: 0805]
C55  100nF  [CAP: 0805]
C56  22UF  [CAP: 0805]
C57  22nF  [CAP: 0805]
C58  100nF  [CAP: 0805]
C59  470nF  [CAP: 0805]
C60  0.1UF  [CAP: 0603]
C61  470nF  [CAP: 0805]
C62  2.2UF  [CAP: 0603]
C63  2.2UF  [CAP: 0603]
C64  2.2nF  [CAP: 0603]
C65  470nF  [CAP: 0805]
C66  470nF  [CAP: 0603]
C67  470nF  [CAP: 0805]
C68  470nF  [CAP: 0805]
C69  2.2nF  [CAP: 0603]
C70  0.1UF  [CAP: 0603]
Q6  IPD053N06NATMA1  [DPAK_3]
Q7  IPD053N06NATMA1  [DPAK_3]
Q8  IPD053N06NATMA1  [DPAK_3]
Q9  IPD053N06NATMA1  [DPAK_3]
Q10  IPD053N06NATMA1  [DPAK_3]
Q11  IPD053N06NATMA1  [DPAK_3]
Q12  IPD053N06NATMA1  [DPAK_3]
Q13  IPD053N06NATMA1  [DPAK_3]
R41  22  [RES: 0603]
R42  50mOhm  [RES: 2512]
R43  22  [RES: 0603]
R44  22  [RES: 0603]
R45  2.2K  [RES: 0603]
R46  22  [RES: 0603]
R47  47  [RES: 0603]
R48  47  [RES: 0603]
R49  22  [RES: 0603]
R50  22  [RES: 0603]
R51  22  [RES: 0603]
R52  22  [RES: 0603]
R53  47  [RES: 0603]
R54  50mOhm  [RES: 2512]
R55  47  [RES: 0603]
U6  TMC5160A-TA-T  [48-TQFP]

### Ports
SA_A (out), SA_B (out), SB_A (out), SB_B (out), SPI_CSN (in), SPI_SCK (in), SPI_SDI (in), SPI_SDO (out)

### Nets
M_VBUS: C54.2(B) C55.2(B) C56.1(A) C58.2(B) C60.2(B) C65.2(B) Q6.4(D) Q7.4(D) Q10.4(D) Q11.4(D) U6.4(VSA) U6.33(VS)
SGND: C54.1(A) C55.1(A) C56.2(B) C60.1(A) C62.1(A) C63.1(A) C65.1(A) C66.1(A) C70.1(A) R42.1 R48.1 R54.1 R55.1 U6.0(EP) U6.6(GNDA) U6.11(TST_MODE) U6.12(CLK) U6.19(GNDD_1) U6.21(SD_MODE) U6.23(ENCB_DCEN_CFG4) U6.24(ENCA_DCIN_CFG5) U6.25(ENCN_DCO_CFG6) U6.28(DRV_ENN) U6.30(GNDD_2)
5VOUT: C63.2(B) R45.2 U6.5(5VOUT)
12VOUT: C62.2(B) U6.3(12VOUT)
CA1: C68.1(A) U6.42(CA1)
CA2: C67.1(A) U6.35(CA2)
CB1: C61.1(A) U6.2(CB1)
CB2: C59.1(A) U6.43(CB2)
DRV_CPI: C57.2(B) U6.32(CPI)
DRV_CPO: C57.1(A) U6.31(CPO)
DRV_VCC: C66.2(B) R45.1 U6.29(VCC)
DRV_VCP: C58.1(A) U6.34(VCP)
HA1: R50.2 U6.41(HA1)
HA2: R49.2 U6.36(HA2)
HB1: R43.2 U6.1(HB1)
HB2: R41.2 U6.44(HB2)
LA1: R51.2 U6.39(LA1)
LA2: R52.2 U6.38(LA2)
LB1: R44.2 U6.47(LB1)
LB2: R46.2 U6.46(LB2)
MISO: U6.16(SDO_CFG0) ; port SPI_SDO
MOSI: U6.15(SDI_CFG1) ; port SPI_SDI
SA_1: Q6.1(G) R50.1
SA_2: Q7.1(G) R49.1
SA_3: Q8.1(G) R51.1
SA_4: Q9.1(G) R52.1
SA_A: C68.2(B) Q6.3(S) Q8.4(D) U6.40(BMA1) ; port SA_A
SA_B: C67.2(B) Q7.3(S) Q9.4(D) U6.37(BMA2) ; port SA_B
SA_LOW: Q8.3(S) Q9.3(S) R42.2 R47.1
SB_1: Q10.1(G) R43.1
SB_2: Q11.1(G) R41.1
SB_3: Q12.1(G) R44.1
SB_4: Q13.1(G) R46.1
SB_A: C61.2(B) Q10.3(S) Q12.4(D) U6.48(BMB1) ; port SB_A
SB_B: C59.2(B) Q11.3(S) Q13.4(D) U6.45(BMB2) ; port SB_B
SB_LOW: Q12.3(S) Q13.3(S) R53.1 R54.2
SCK: U6.14(SCK_CFG2) ; port SPI_SCK
SCSN: U6.13(CSN_CFG3) ; port SPI_CSN
SRAH: C64.2(B) R47.2 U6.8(SRAH)
SRAL: C64.1(A) R48.2 U6.7(SRAL)
SRBH: C69.2(B) R53.2 U6.9(SRBH)
SRBL: C69.1(A) R55.2 U6.10(SRBL)
VIO: C70.2(B) U6.20(VCC_IO) U6.22(SPI_MODE)

Not connected (* = marked no-connect by the designer): U6 17(REFL_STEP)* 18(REFR_DIR)* 26(DIAG0_SWN)* 27(DIAG1_SWP)*

### Notes on the sheet
- Size:
- Date:
- Sheet Name:
- A3
- Sheet
- Time:
- of
- Author :
- Hatim Saad
- Project:
- File:

### Library data of the parts
C54-C59 C61 C65 C67 C68 = CAP 0805: CAP SMD 0805
C60 C62-C64 C66 C69 C70 = CAP 0603: CAP SMD 0603
Q6-Q13 = IPD053N06NATMA1: MOSFETs N-Ch 60V 45A DPAK-2; Supplier 1: Mouser; Supplier Part Number 1: 726-IPD053N06NATMA1
R41 R43-R53 R55 = RES 0603: RES SMD 0603
R42 R54 = TLRP3A20WR050FTE: Current Sense Resistors - SMD TLRP 2512 2.0W R050 1% 75PPM 4K RL; Supplier 1: Mouser; Supplier Part Number 1: 279-TLRP3A20WR050FTE
U6 = TMC5160A-TA-T: Motor/Motion/Ignition Controllers & Drivers Stepper motor cDriver 8 to 60V, for external N-Fets with S/D and SPI Interface, 256 Steps, SixPoint ramp controller, CoolStep, StallGuard2, SpreadCycle and StealthChop2; Supplier 1: Mouser; Supplier Part Number 1: 700-TMC5160A-TA-T

## Sheet MCU.SchDoc
size A4; SheetNumber: 8; SheetTotal: 9
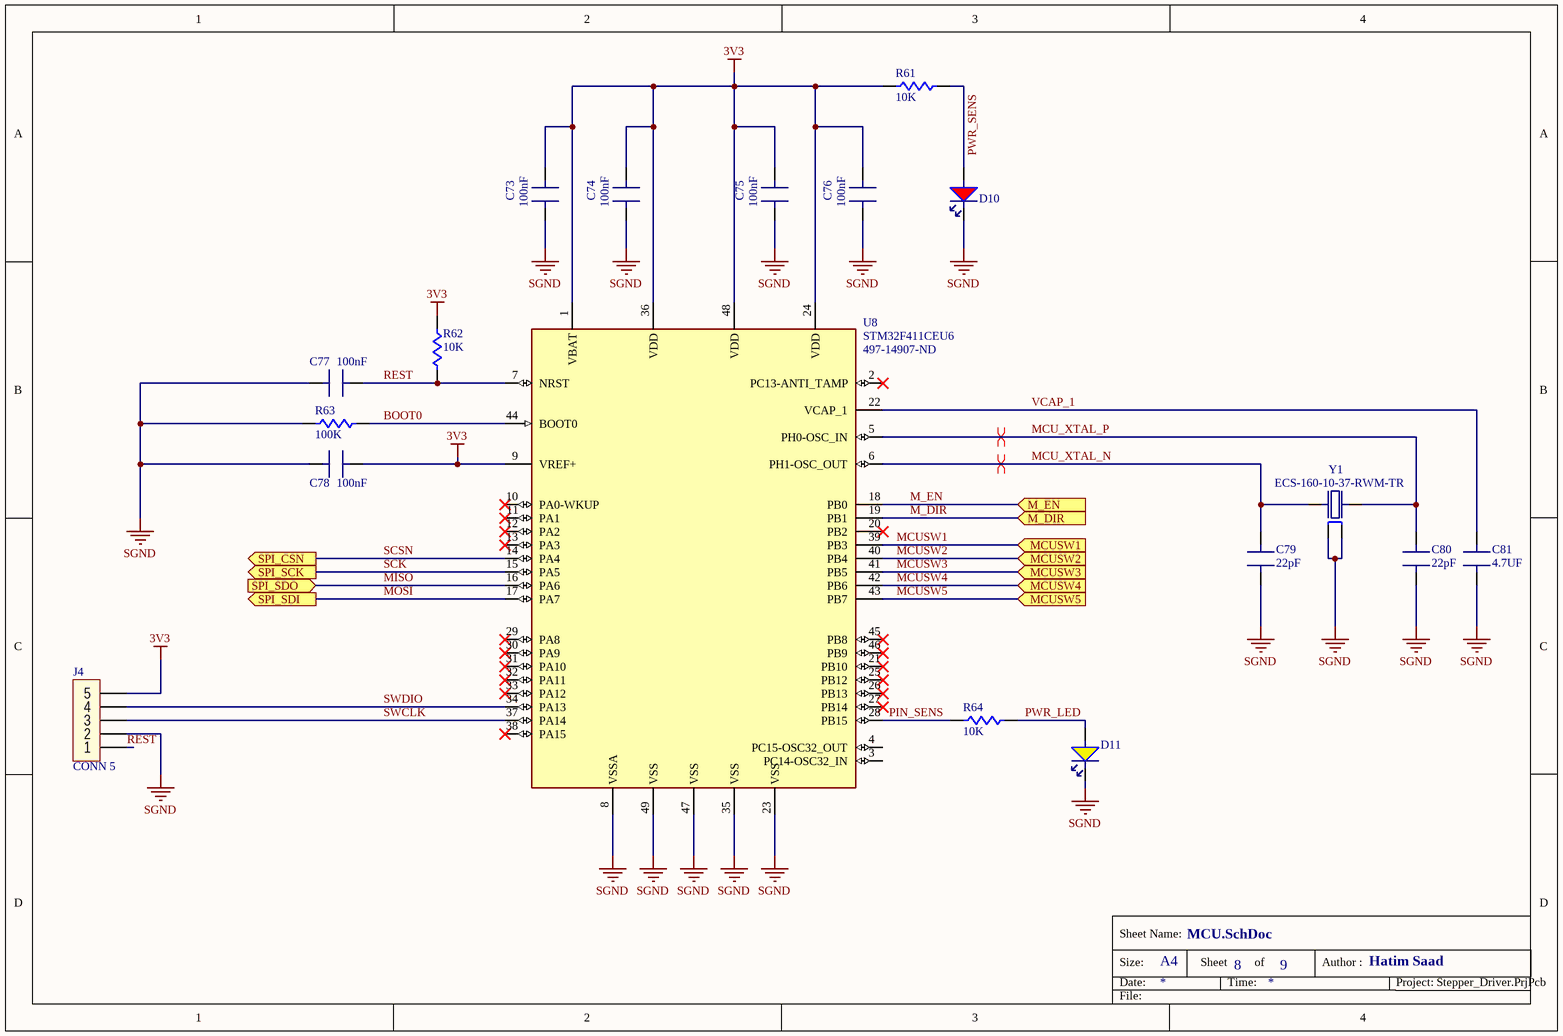
[diagram p5: MCU.SchDoc]

### Parts
C73  100nF  [CAP: 0603]
C74  100nF  [CAP: 0603]
C75  100nF  [CAP: 0603]
C76  100nF  [CAP: 0603]
C77  100nF  [CAP: 0603]
C78  100nF  [CAP: 0603]
C79  22pF  [CAP: 0603]
C80  22pF  [CAP: 0603]
C81  4.7UF  [CAP: 0603]
D10  RED  [LED: 0603R]  (value not drawn)
D11  YELLOW  [LED: 0603Y]  (value not drawn)
J4  CONN 5  [CON: PLS-5]
R61  10K  [RES: 0603]
R62  10K  [RES: 0603]
R63  100K  [RES: 0603]
R64  10K  [RES: 0603]
U8  STM32F411CEU6  Supplier Part Number 1: 497-14907-ND  [STM32F411CEU6]
Y1  ECS-160-10-37-RWM-TR  [OSC: 2016]

### Ports
M_DIR (in), M_EN (in), MCUSW1 (in), MCUSW2 (in), MCUSW3 (in), MCUSW4 (in), MCUSW5 (in), SPI_CSN (out), SPI_SCK (out), SPI_SDI (out), SPI_SDO (in)

### Nets
3V3: C73.2(B) C74.2(B) C75.2(B) C76.2(B) C78.1(A) J4.5 R61.1 R62.1 U8.1(VBAT) U8.9(VREF+) U8.24(VDD) U8.36(VDD) U8.48(VDD)
SGND: C73.1(A) C74.1(A) C75.1(A) C76.1(A) C77.2(B) C78.2(B) C79.2(B) C80.2(B) C81.2(B) D10.1(C) D11.1(C) J4.2 R63.1 U8.8(VSSA) U8.23(VSS) U8.35(VSS) U8.47(VSS) U8.49(VSS) Y1.2(GND) Y1.4(GND)
BOOT0: R63.2 U8.44(BOOT0)
M_DIR: U8.19(PB1) ; port M_DIR
M_EN: U8.18(PB0) ; port M_EN
MCU_XTAL_N: C79.1(A) U8.6(PH1-OSC_OUT) Y1.3(XTAL2)
MCU_XTAL_P: C80.1(A) U8.5(PH0-OSC_IN) Y1.1(XTAL1)
MCUSW1: U8.39(PB3) ; port MCUSW1
MCUSW2: U8.40(PB4) ; port MCUSW2
MCUSW3: U8.41(PB5) ; port MCUSW3
MCUSW4: U8.42(PB6) ; port MCUSW4
MCUSW5: U8.43(PB7) ; port MCUSW5
MISO: U8.16(PA6) ; port SPI_SDO
MOSI: U8.17(PA7) ; port SPI_SDI
PIN_SENS: R64.2 U8.28(PB15)
PWR_LED: D11.2(A) R64.1
PWR_SENS: D10.2(A) R61.2
REST: C77.1(A) J4.1 R62.2 U8.7(NRST)
SCK: U8.15(PA5) ; port SPI_SCK
SCSN: U8.14(PA4) ; port SPI_CSN
SWCLK: J4.3 U8.37(PA14)
SWDIO: J4.4 U8.34(PA13)
VCAP_1: C81.1(A) U8.22(VCAP_1)

Not connected (* = marked no-connect by the designer): U8 2(PC13-ANTI_TAMP)* 3(PC14-OSC32_IN) 4(PC15-OSC32_OUT) 10(PA0-WKUP)* 11(PA1)* 12(PA2)* 13(PA3)* 20(PB2)* 21(PB10)* 25(PB12)* 26(PB13)* 27(PB14)* 29(PA8)* 30(PA9)* 31(PA10)* 32(PA11)* 33(PA12)* 38(PA15)* 45(PB8)* 46(PB9)*

### Layout directives
differential pair: MCU_XTAL_N, MCU_XTAL_P

### Notes on the sheet
- Size:
- Date:
- Sheet Name:
- A4
- Sheet
- Time:
- of
- Author :
- Hatim Saad
- Project:
- File:

### Library data of the parts
C73-C81 = CAP 0603: CAP SMD 0603
D10 = LED RED 0603: LED RED CLEAR 0603 SMD
D11 = LED YELLOW 0603: LED YELLOW CLEAR 0603 SMD
R61-R64 = RES 0603: RES SMD 0603
U8 = STM32F411CEU6: IC MCU 32BIT 512KB FLSH 48UFQFPN; Manufacturer: STMicroelectronics; Interface: I2C,SPI,USB,IrDA,MMC,SDIO,SD,UART,USART,LIN,I2S; Number of I/Os: 36; Frequency: 100MHz; Oscillator Type: Internal; Memory Type: FLASH; Peripherals: Brown-out Detect/Reset,POR,PWM,WDT,DMA; Core Architecture: ARM; RAM Size: 128KB; Max Power Dissipation: 625mW; Number of Timers/Counters: 8; Min Supply Voltage: 1.7V; Max Supply Voltage: 3.6V; Data Bus Width: 32b; Watchdog Timer: Yes; Number of ADC Channels: 16; Operating Supply Voltage: 3.3V; Supplier 1: Digi-Key; Manufacturer Part Number: STM32F411CEU6; Mount: Surface Mount; Case/Package: UFQFPN; Number of Pins: 48; Min Operating Temperature: -40°C; Max Operating Temperature: 85°C; Packaging: Tray; Memory Size: 512KB; Number of Programmable I/O: 36; Max Frequency: 100MHz; Package Quantity: 1560; Length: 7mm; Width: 7mm; Radiation Hardening: No; Lead Free: Lead Free; RoHS Compliant: Yes; REACH SVHC: No SVHC
Y1 = XC2119DKR-ND: CRYSTAL 16.0000MHZ 10PF SMD; Supplier 1: Mouser; Supplier Part Number 1: 520-160-10-37-RWM-T

## Sheet User_Interface.SchDoc
size A4; SheetNumber: 9; SheetTotal: 9
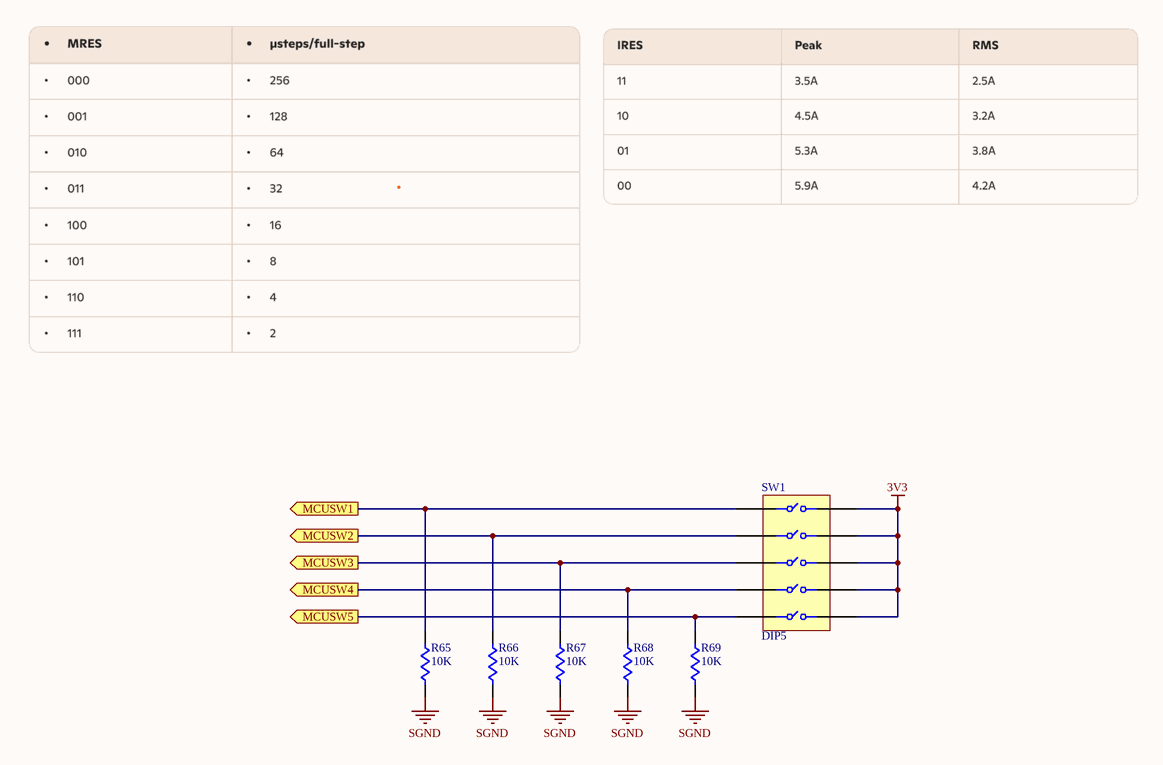
[diagram p6: User_Interface.SchDoc]

### Parts
R65  10K  [RES: 0603]
R66  10K  [RES: 0603]
R67  10K  [RES: 0603]
R68  10K  [RES: 0603]
R69  10K  [RES: 0603]
SW1  DIP5  [DIPSW254_5]

### Ports
MCUSW1 (out), MCUSW2 (out), MCUSW3 (out), MCUSW4 (out), MCUSW5 (out)

### Nets
3V3: SW1.6(NO_5) SW1.7(NO_4) SW1.8(NO_3) SW1.9(NO_2) SW1.10(NO_1)
SGND: R65.2 R66.2 R67.2 R68.2 R69.2
MCUSW1: R65.1 SW1.1(COM1) ; port MCUSW1
MCUSW2: R66.1 SW1.2(COM2) ; port MCUSW2
MCUSW3: R67.1 SW1.3(COM3) ; port MCUSW3
MCUSW4: R68.1 SW1.4(COM4) ; port MCUSW4
MCUSW5: R69.1 SW1.5(COM5) ; port MCUSW5

### Notes on the sheet
- Size:
- Date:
- Sheet Name:
- A4
- Sheet
- Time:
- of
- Author :
- Hatim Saad
- Project:
- File:

### Library data of the parts
R65-R69 = RES 0603: RES SMD 0603
SW1 = DIP SW_5: DIP Switch 5

## Sheet Motor_Output.SchDoc
size A4; SheetNumber: 6; SheetTotal: 9
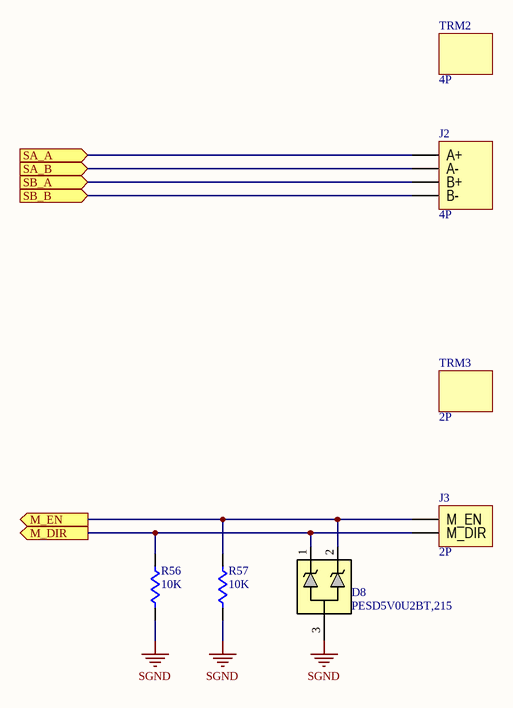
[diagram p7: Motor_Output.SchDoc]

### Parts
D8  PESD5V0U2BT,215  [SOT23_3]
J2  4P  [691313510004]
J3  2P  [691313510002]
R56  10K  [RES: 0603]
R57  10K  [RES: 0603]
TRM2  4P  (mechanical)
TRM3  2P  (mechanical)

### Ports
M_DIR (out), M_EN (out), SA_A (in), SA_B (in), SB_A (in), SB_B (in)

### Nets
SGND: D8.3(CC) R56.2 R57.2
M_DIR: D8.1(K1) J3.1(M_DIR) R56.1 ; port M_DIR
M_EN: D8.2(K2) J3.2(M_EN) R57.1 ; port M_EN
SA_A: J2.1(A+) ; port SA_A
SA_B: J2.2(A-) ; port SA_B
SB_A: J2.3(B+) ; port SB_A
SB_B: J2.4(B-) ; port SB_B

### Notes on the sheet
- Size:
- Date:
- Sheet Name:
- A4
- Sheet
- Time:
- of
- Author :
- Hatim Saad
- Project:
- File:

### Library data of the parts
D8 = PESD5V0U2BT,215: ESD Protection Diodes / TVS Diodes ESD 5V BI; Supplier 1: Mouser; Supplier Part Number 1: 771-PESD5V0U2BTT/R
J2 = 691313510004: Pluggable Terminal Blocks WR-TBL 300VAC 20A 4P Right Angle; Supplier 1: Mouser; Supplier Part Number 1: 710-691313510004
J3 = 691313510002: Pluggable Terminal Blocks WR-TBL 300VAC 20A 2P Right Angle; Supplier 1: Mouser; Supplier Part Number 1: 710-691313510002
R56 R57 = RES 0603: RES SMD 0603
TRM2 = 691351500004: Pluggable Terminal Blocks WR-TBL 300VAC 20A 4P Right Angle; Supplier 1: Mouser; Supplier Part Number 1: 710-691351500004
TRM3 = 691351500002: Pluggable Terminal Blocks WR-TBL 300VAC 20A 2P Right Angle; Supplier 1: Mouser; Supplier Part Number 1: 710-691351500002

## Sheet Buck_Converter.SchDoc
size A4; SheetNumber: 7; SheetTotal: 9
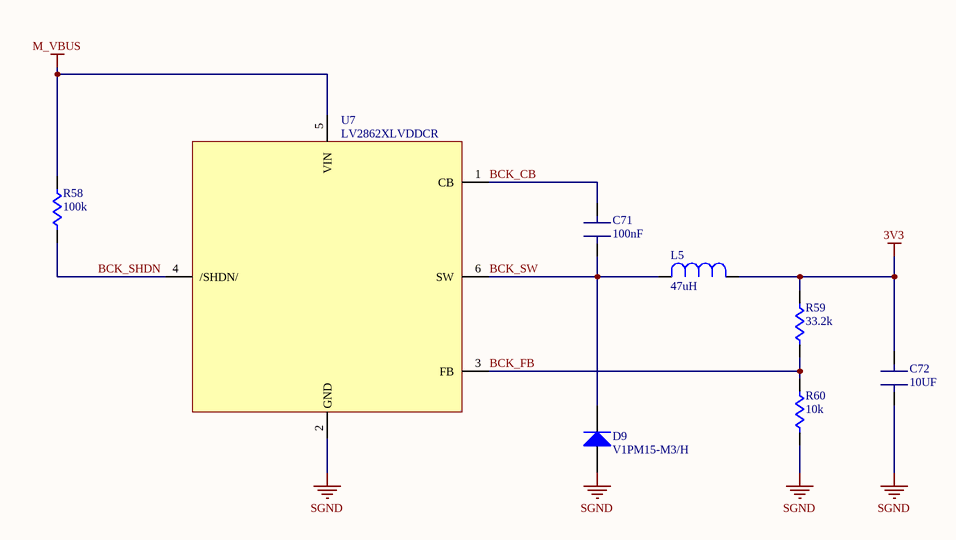
[diagram p8: Buck_Converter.SchDoc]

### Parts
C71  100nF  [CAP: 0603]
C72  10UF  [CAP: 0805]
D9  V1PM15-M3/H  [DO-219AD-2]
L5  47uH  [MDH6045C]
R58  100k  [RES: 0603]
R59  33.2k  [RES: 0603]
R60  10k  [RES: 0603]
U7  LV2862XLVDDCR  [SOT23-6]

### Nets
3V3: C72.2(B) L5.2 R59.2
M_VBUS: R58.2 U7.5(VIN)
SGND: C72.1(A) D9.2(A) R60.1 U7.2(GND)
BCK_CB: C71.2(B) U7.1(CB)
BCK_FB: R59.1 R60.2 U7.3(FB)
BCK_SHDN: R58.1 U7.4(/SHDN/)
BCK_SW: C71.1(A) D9.1(K) L5.1 U7.6(SW)

### Notes on the sheet
- Size:
- Date:
- Sheet Name:
- A4
- Sheet
- Time:
- of
- Author :
- Hatim Saad
- Project:
- File:

### Library data of the parts
C71 = CAP 0603: CAP SMD 0603
C72 = CAP 0805: CAP SMD 0805
D9 = V1PM15-M3/H: as D5 on sheet Isolated_DCDC; Supplier 1: Mouser; Supplier Part Number 1: 78-V1PM15-M3/H
L5 = MDH6045C-470MA=P3: Power Inductors - SMD 47uH 208mOhms 20 % 1A AEC-Q200; Supplier 1: Mouser; Supplier Part Number 1: 81-MDH6045C-470MA=P3
R58-R60 = RES 0603: RES SMD 0603
U7 = LV2862XLVDDCR: Switching Voltage Regulators 4.5-V to 60-V 600-m A buck converter in A 595-LV2862XLVDDCT; Supplier 1: Mouser; Supplier Part Number 1: 595-LV2862XLVDDCR

## Nets that join several sheets
3V3: MCU (13 pins), User_Interface (5 pins), Buck_Converter (C72.2 L5.2 R59.2)
Chassis: Block_Diagram (MH1.1), Input_Filter (C2.1 C4.2 J1.3)
M_VBUS: Isolated_DCDC (13 pins), H_Bridge (12 pins), Buck_Converter (R58.2 U7.5)
PGND: Block_Diagram (C1.1), Input_Filter (C5.2 RECT1.4 U1.3), PFC_Controller (33 pins), Isolated_DCDC (25 pins)
SGND: Block_Diagram (C1.2), Isolated_DCDC (14 pins), H_Bridge (24 pins), MCU (20 pins), User_Interface (5 pins), Motor_Output (D8.3 R56.2 R57.2), Buck_Converter (C72.1 D9.2 R60.1 U7.2)
M_DIR: MCU (U8.19), Motor_Output (D8.1 J3.1 R56.1)
M_EN: MCU (U8.18), Motor_Output (D8.2 J3.2 R57.1)
MCUSW1: MCU (U8.39), User_Interface (R65.1 SW1.1)
MCUSW2: MCU (U8.40), User_Interface (R66.1 SW1.2)
MCUSW3: MCU (U8.41), User_Interface (R67.1 SW1.3)
MCUSW4: MCU (U8.42), User_Interface (R68.1 SW1.4)
MCUSW5: MCU (U8.43), User_Interface (R69.1 SW1.5)
MISO: H_Bridge (U6.16), MCU (U8.16)
MOSI: H_Bridge (U6.15), MCU (U8.17)
SA_A: H_Bridge (C68.2 Q6.3 Q8.4 U6.40), Motor_Output (J2.1)
SA_B: H_Bridge (C67.2 Q7.3 Q9.4 U6.37), Motor_Output (J2.2)
SB_A: H_Bridge (C61.2 Q10.3 Q12.4 U6.48), Motor_Output (J2.3)
SB_B: H_Bridge (C59.2 Q11.3 Q13.4 U6.45), Motor_Output (J2.4)
SCK: H_Bridge (U6.14), MCU (U8.15)
SCSN: H_Bridge (U6.13), MCU (U8.14)
V_DCDC: PFC_Controller (6 pins), Isolated_DCDC (C29.2 Q3.2 R22.2 R35.1)
V_PFC: Input_Filter (C5.1 U1.4), PFC_Controller (C10.2 C11.2 U2.15)
V_RAW+: Input_Filter (RECT1.1), PFC_Controller (L2.1 L3.1 R2.2)